# EAGLE schematic MCB1 (EAGLE 8.0.0)
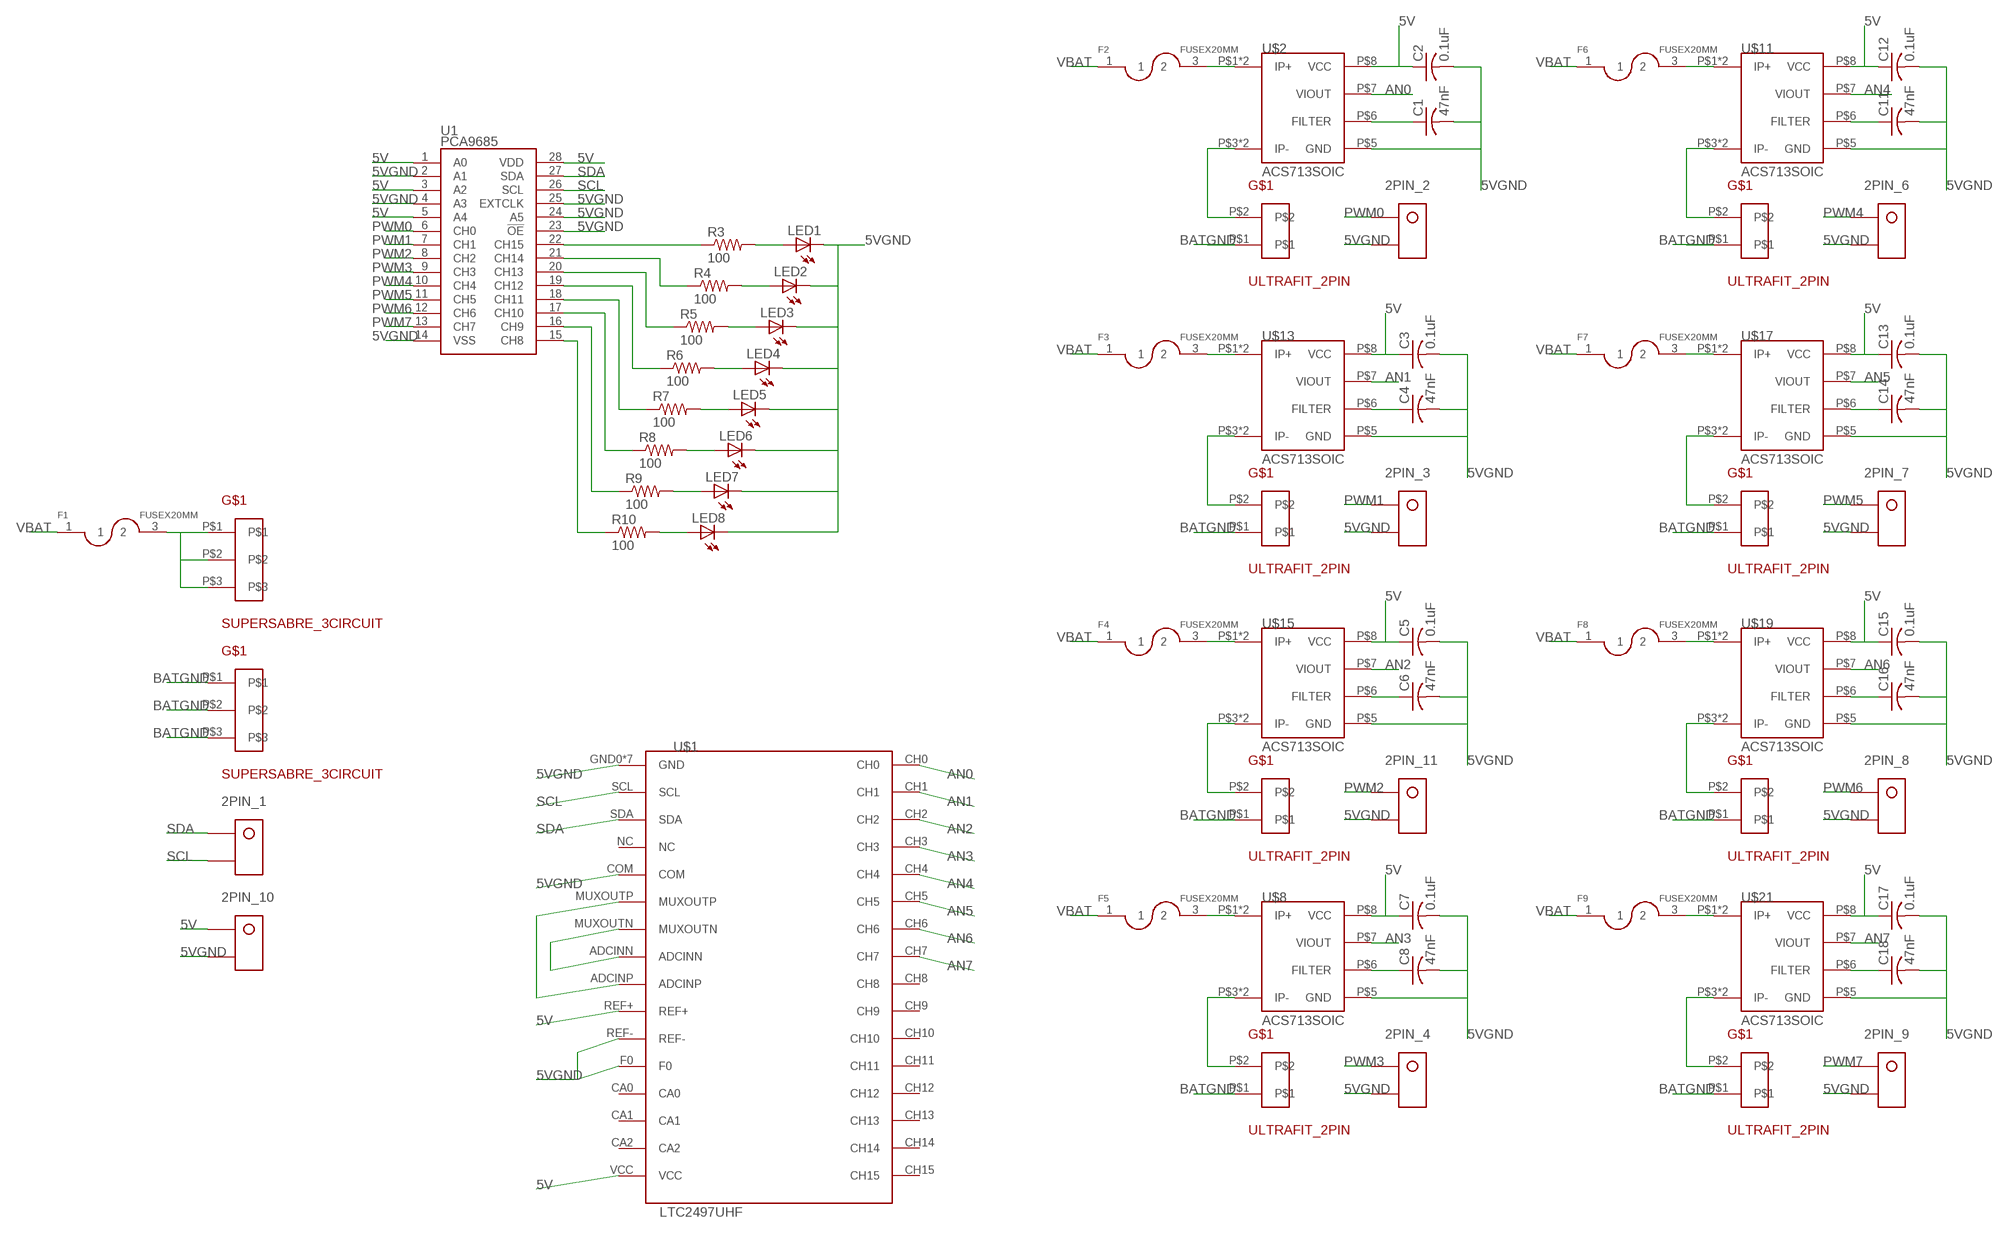
[diagram p0: schematic, sheet 1]

## Parts
2PIN_1  KK254_VERT_2PIN22-29-2021  [KK254_VERT_2PIN]
2PIN_2  KK254_VERT_2PIN22-29-2021  [KK254_VERT_2PIN]
2PIN_3  KK254_VERT_2PIN22-29-2021  [KK254_VERT_2PIN]
2PIN_4  KK254_VERT_2PIN22-29-2021  [KK254_VERT_2PIN]
2PIN_6  KK254_VERT_2PIN22-29-2021  [KK254_VERT_2PIN]
2PIN_7  KK254_VERT_2PIN22-29-2021  [KK254_VERT_2PIN]
2PIN_8  KK254_VERT_2PIN22-29-2021  [KK254_VERT_2PIN]
2PIN_9  KK254_VERT_2PIN22-29-2021  [KK254_VERT_2PIN]
2PIN_10  KK254_VERT_2PIN22-29-2021  [KK254_VERT_2PIN]
2PIN_11  KK254_VERT_2PIN22-29-2021  [KK254_VERT_2PIN]
C1  47nF  C-USC0805  [C0805]
C2  0.1uF  C-USC0805  [C0805]
C3  0.1uF  C-USC0805  [C0805]
C4  47nF  C-USC0805  [C0805]
C5  0.1uF  C-USC0805  [C0805]
C6  47nF  C-USC0805  [C0805]
C7  0.1uF  C-USC0805  [C0805]
C8  47nF  C-USC0805  [C0805]
C11  47nF  C-USC0805  [C0805]
C12  0.1uF  C-USC0805  [C0805]
C13  0.1uF  C-USC0805  [C0805]
C14  47nF  C-USC0805  [C0805]
C15  0.1uF  C-USC0805  [C0805]
C16  47nF  C-USC0805  [C0805]
C17  0.1uF  C-USC0805  [C0805]
C18  47nF  C-USC0805  [C0805]
F1  FUSEX20MM  [FUSE_5MM]
F2  FUSEX20MM  [FUSE_5MM]
F3  FUSEX20MM  [FUSE_5MM]
F4  FUSEX20MM  [FUSE_5MM]
F5  FUSEX20MM  [FUSE_5MM]
F6  FUSEX20MM  [FUSE_5MM]
F7  FUSEX20MM  [FUSE_5MM]
F8  FUSEX20MM  [FUSE_5MM]
F9  FUSEX20MM  [FUSE_5MM]
LED1  LEDCHIPLED_0805  [CHIPLED_0805]
LED2  LEDCHIPLED_0805  [CHIPLED_0805]
LED3  LEDCHIPLED_0805  [CHIPLED_0805]
LED4  LEDCHIPLED_0805  [CHIPLED_0805]
LED5  LEDCHIPLED_0805  [CHIPLED_0805]
LED6  LEDCHIPLED_0805  [CHIPLED_0805]
LED7  LEDCHIPLED_0805  [CHIPLED_0805]
LED8  LEDCHIPLED_0805  [CHIPLED_0805]
R3  100  R-US_R0805  [R0805]
R4  100  R-US_R0805  [R0805]
R5  100  R-US_R0805  [R0805]
R6  100  R-US_R0805  [R0805]
R7  100  R-US_R0805  [R0805]
R8  100  R-US_R0805  [R0805]
R9  100  R-US_R0805  [R0805]
R10  100  R-US_R0805  [R0805]
U1  PCA9685  [TSSOP-28_4MM]
U$1  LTC2497UHF  [LTC2497-UHF]
U$2  ACS713SOIC  [ACS713-SOIC]
U$3  SUPERSABRE_3CIRCUIT  [SUPERSABRE_3CIRCUIT]
U$4  SUPERSABRE_3CIRCUIT  [SUPERSABRE_3CIRCUIT]
U$5  ULTRAFIT_2PIN  [ULTRAFIT_2PIN]
U$6  ULTRAFIT_2PIN  [ULTRAFIT_2PIN]
U$7  ULTRAFIT_2PIN  [ULTRAFIT_2PIN]
U$8  ACS713SOIC  [ACS713-SOIC]
U$11  ACS713SOIC  [ACS713-SOIC]
U$12  ULTRAFIT_2PIN  [ULTRAFIT_2PIN]
U$13  ACS713SOIC  [ACS713-SOIC]
U$14  ULTRAFIT_2PIN  [ULTRAFIT_2PIN]
U$15  ACS713SOIC  [ACS713-SOIC]
U$16  ULTRAFIT_2PIN  [ULTRAFIT_2PIN]
U$17  ACS713SOIC  [ACS713-SOIC]
U$18  ULTRAFIT_2PIN  [ULTRAFIT_2PIN]
U$19  ACS713SOIC  [ACS713-SOIC]
U$20  ULTRAFIT_2PIN  [ULTRAFIT_2PIN]
U$21  ACS713SOIC  [ACS713-SOIC]

## Nets
5V: 2PIN_10.P$1 C2.1 C3.1 C5.1 C7.1 C12.1 C13.1 C15.1 C17.1 U1.1(A0) U1.3(A2) U1.5(A4) U1.28(VDD) U$1.REF+ U$1.VCC U$2.P$8(VCC) U$8.P$8(VCC) U$11.P$8(VCC) U$13.P$8(VCC) U$15.P$8(VCC) U$17.P$8(VCC) U$19.P$8(VCC) U$21.P$8(VCC)
5VGND: 2PIN_2.P$2 2PIN_3.P$2 2PIN_4.P$2 2PIN_6.P$2 2PIN_7.P$2 2PIN_8.P$2 2PIN_9.P$2 2PIN_10.P$2 2PIN_11.P$2 C1.2 C2.2 C3.2 C4.2 C5.2 C6.2 C7.2 C8.2 C11.2 C12.2 C13.2 C14.2 C15.2 C16.2 C17.2 C18.2 LED1.C LED2.C LED3.C LED4.C LED5.C LED6.C LED7.C LED8.C U1.2(A1) U1.4(A3) U1.14(VSS) U1.23(!OE) U1.24(A5) U1.25(EXTCLK) U$1.COM U$1.F0 U$1.GND0(GND) U$1.GND1(GND) U$1.GND2(GND) U$1.GND3(GND) U$1.GND4(GND) U$1.GND5(GND) U$1.GND6(GND) U$1.REF- U$2.P$5(GND) U$8.P$5(GND) U$11.P$5(GND) U$13.P$5(GND) U$15.P$5(GND) U$17.P$5(GND) U$19.P$5(GND) U$21.P$5(GND)
AN0: U$1.CH0 U$2.P$7(VIOUT)
AN1: U$1.CH1 U$13.P$7(VIOUT)
AN2: U$1.CH2 U$15.P$7(VIOUT)
AN3: U$1.CH3 U$8.P$7(VIOUT)
AN4: U$1.CH4 U$11.P$7(VIOUT)
AN5: U$1.CH5 U$17.P$7(VIOUT)
AN6: U$1.CH6 U$19.P$7(VIOUT)
AN7: U$1.CH7 U$21.P$7(VIOUT)
BATGND: U$3.P$1 U$3.P$2 U$3.P$3 U$5.P$1 U$6.P$1 U$7.P$1 U$12.P$1 U$14.P$1 U$16.P$1 U$18.P$1 U$20.P$1
N$1: C1.1 U$2.P$6(FILTER)
N$2: U$2.P$3(IP-) U$2.P$4(IP-) U$5.P$2
N$3: U$1.ADCINP U$1.MUXOUTP
N$4: U$1.ADCINN U$1.MUXOUTN
N$5: U$14.P$2 U$15.P$3(IP-) U$15.P$4(IP-)
N$6: U$6.P$2 U$13.P$3(IP-) U$13.P$4(IP-)
N$7: C6.1 U$15.P$6(FILTER)
N$8: U$7.P$2 U$8.P$3(IP-) U$8.P$4(IP-)
N$9: C8.1 U$8.P$6(FILTER)
N$10: C4.1 U$13.P$6(FILTER)
N$11: F1.3 U$4.P$1 U$4.P$2 U$4.P$3
N$12: F2.3 U$2.P$1(IP+) U$2.P$2(IP+)
N$13: C11.1 U$11.P$6(FILTER)
N$14: U$11.P$3(IP-) U$11.P$4(IP-) U$12.P$2
N$15: U$16.P$2 U$17.P$3(IP-) U$17.P$4(IP-)
N$16: C14.1 U$17.P$6(FILTER)
N$17: U$18.P$2 U$19.P$3(IP-) U$19.P$4(IP-)
N$18: C16.1 U$19.P$6(FILTER)
N$19: U$20.P$2 U$21.P$3(IP-) U$21.P$4(IP-)
N$20: C18.1 U$21.P$6(FILTER)
N$21: F3.3 U$13.P$1(IP+) U$13.P$2(IP+)
N$22: F4.3
N$23: R4.1 U1.21(CH14)
N$24: R10.1 U1.15(CH8)
N$25: F5.3
N$26: F6.3 U$11.P$1(IP+) U$11.P$2(IP+)
N$27: R7.1 U1.18(CH11)
N$28: R9.1 U1.16(CH9)
N$29: R8.1 U1.17(CH10)
N$30: R6.1 U1.19(CH12)
N$31: R5.1 U1.20(CH13)
N$32: R3.1 U1.22(CH15)
N$33: F7.3 U$17.P$1(IP+) U$17.P$2(IP+)
N$34: F8.3 U$19.P$1(IP+) U$19.P$2(IP+)
N$35: F9.3 U$21.P$1(IP+) U$21.P$2(IP+)
N$36: LED1.A R3.2
N$37: LED2.A R4.2
N$38: LED3.A R5.2
N$39: LED4.A R6.2
N$40: LED5.A R7.2
N$41: LED6.A R8.2
N$42: LED7.A R9.2
N$43: LED8.A R10.2
PWM0: 2PIN_2.P$1 U1.6(CH0)
PWM1: 2PIN_3.P$1 U1.7(CH1)
PWM2: 2PIN_11.P$1 U1.8(CH2)
PWM3: 2PIN_4.P$1 U1.9(CH3)
PWM4: 2PIN_6.P$1 U1.10(CH4)
PWM5: 2PIN_7.P$1 U1.11(CH5)
PWM6: 2PIN_8.P$1 U1.12(CH6)
PWM7: 2PIN_9.P$1 U1.13(CH7)
SCL: 2PIN_1.P$2 U1.26(SCL) U$1.SCL
SDA: 2PIN_1.P$1 U1.27(SDA) U$1.SDA
VBAT: F1.1 F2.1 F3.1 F4.1 F5.1 F6.1 F7.1 F8.1 F9.1
Unconnected: U$1.CA0 U$1.CA1 U$1.CA2 U$1.CH8 U$1.CH9 U$1.CH10 U$1.CH11 U$1.CH12 U$1.CH13 U$1.CH14 U$1.CH15 U$1.NC U$8.P$1(IP+) U$8.P$2(IP+) U$15.P$1(IP+) U$15.P$2(IP+)

## Library data of the parts
2PIN_1-2PIN_4 2PIN_6-2PIN_11 = molex:KK254_VERT_2PIN: KK® 254 Wire-to-Board Header, Vertical, with Friction Lock, 2 Circuits, Gold (Au) Plating Part Number: 22-29-2021 http://www.molex.com/molex/products/datasheet.jsp?part=active/0022292021_PCB_HEADERS.xml
C1-C8 C11-C18 = resistor:C-US: CAPACITOR, American symbol
F1-F9 = molex:FUSE
LED1-LED8 = led:LED: LED OSRAM: - CHIPLED LG R971, LG N971, LY N971, LG Q971, LY Q971, LO R971, LY R971 LH N974, LH R974 LS Q976, LO Q976, LY Q976 LO Q996 - Hyper CHIPLED LW Q18S LB Q993, LB Q99A, LB R99A - SideLED LS A670, LO A670, LY A670, LG A670, LP A670 LB A673, LV A673, LT A673, LW A673 LH A674 LY A675 LS A676, LA A676, LO A676, LY A676, LW A676 LS A679, LY A679, LG A679 - Hyper Micro SIDELED® LS Y876, LA Y876, LO Y876, LY Y876 LT Y87S - SmartLED LW L88C, LW L88S LB L89C, LB L89S, LG L890 LS L89K, LO L89K, LY L89K LS L896, LA L896, LO L896, LY L896 - TOPLED LS T670, LO T670, LY T670, LG T670, LP T670 LSG T670, LSP T670, LSY T670, LOP T670, LYG T670 LG T671, LOG T671, LSG T671 LB T673, LV T673, LT T673, LW T673 LH T674 LS T676, LA T676, LO T676, LY T676, LB T676, LH T676, LSB T676, LW T676 LB T67C, LV T67C, LT T67C, LS T67K, LO T67K, LY T67K, LW E67C LS E67B, LA E67B, LO E67B, LY E67B, LB E67C, LV E67C, LT E67C LW T67C LS T679, LY T679, LG T679 LS T770, LO T770, LY T770, LG T770, LP T770 LB T773, LV T773, LT T773, LW T773 LH T774 LS E675, LA E675, LY E675, LS T675 LS T776, LA T776, LO T776, LY T776, LB T776 LHGB T686 LT T68C, LB T68C - Hyper Mini TOPLED® LB M676 - Mini TOPLED Santana® LG M470 LS M47K, LO M47K, LY M47K Source: http://www.osram.convergy.de LUXEON: - LUMILED® LXK2-PW12-R00, LXK2-PW12-S00, LXK2-PW14-U00, LXK2-PW14-V00 LXK2-PM12-R00, LXK2-PM12-S00, LXK2-PM14-U00 LXK2-PE12-Q00, LXK2-PE12-R00, LXK2-PE12-S00, LXK2-PE14-T00, LXK2-PE14-U00 LXK2-PB12-K00, LXK2-PB12-L00, LXK2-PB12-M00, LXK2-PB14-N00, LXK2-PB14-P00, LXK2-PB14-Q00 LXK2-PR12-L00, LXK2-PR12-M00, LXK2-PR14-Q00, LXK2-PR14-R00 LXK2-PD12-Q00, LXK2-PD12-R00, LXK2-PD12-S00 LXK2-PH12-R00, LXK2-PH12-S00 LXK2-PL12-P00, LXK2-PL12-Q00, LXK2-PL12-R00 Source: www.luxeon.com KINGBRIGHT: KA-3528ASYC Source: www.kingbright.com
R3-R10 = resistor:R-US_: RESISTOR, American symbol
U1 = SparkFun-DigitalIC:PCA9685: 16-channel 12-bit PWM I2C interface Internal Oscillator 40Hz to 1kHz Can be totem pole or open collector 2.3V to 5.5V; PROD_ID: IC-12240
U$1 = linear:LTC2497
U$2 U$8 U$11 U$13 U$15 U$17 U$19 U$21 = allegro:ACS713
U$3 U$4 = molex:SUPERSABRE_3CIRCUIT
U$5-U$7 U$12 U$14 U$16 U$18 U$20 = molex:ULTRAFIT_2PIN